# EAGLE design utrak-v2 (EAGLE 7.7.0)
uTrak Balloon Tracker Version 1.0
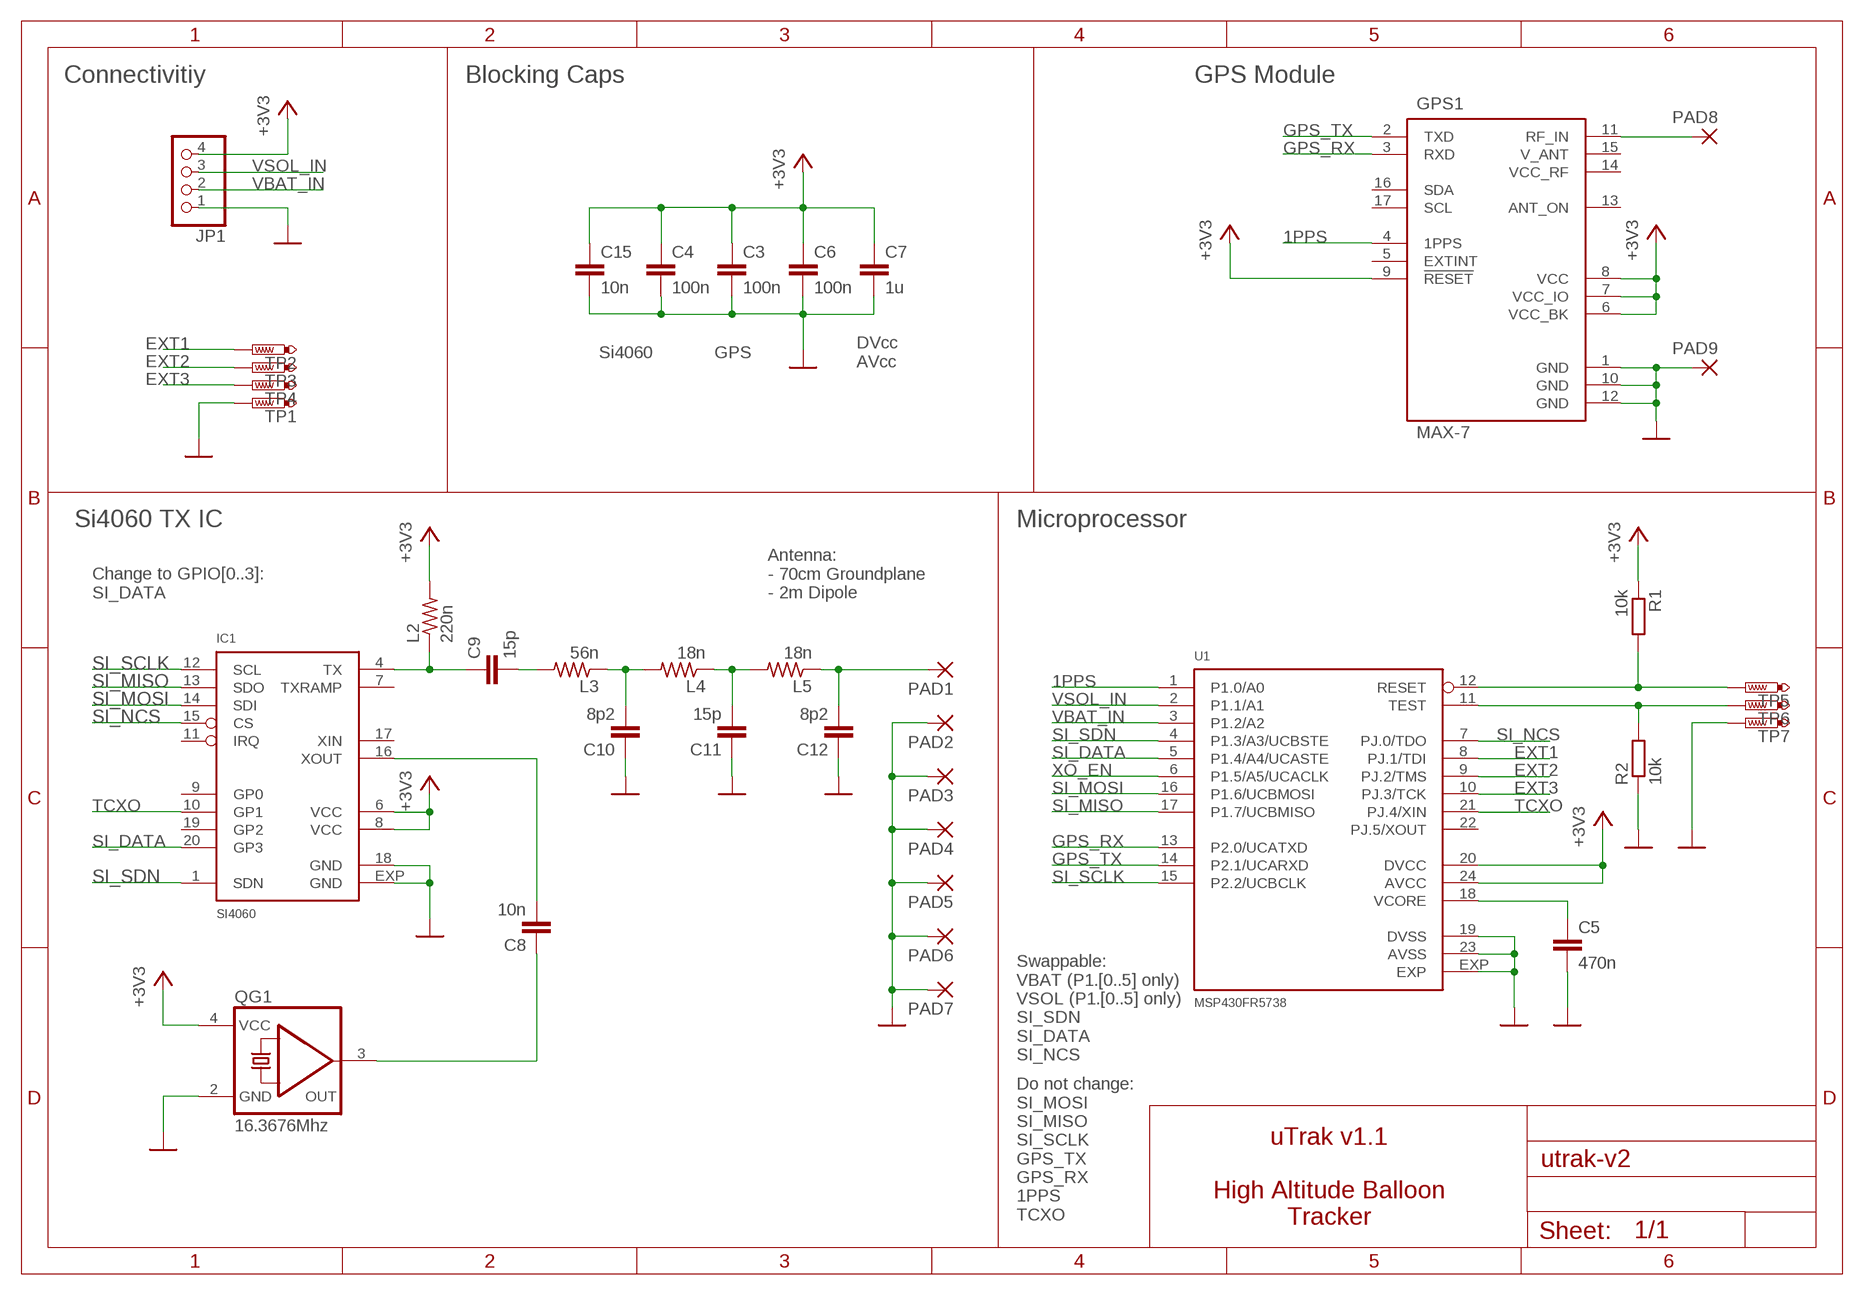
[diagram p0: schematic, sheet 1]

## Parts
C3  100n  C-EUC0402  [C0402]
C4  100n  C-EUC0402  [C0402]
C5  470n  C-EUC0603  [C0603]
C6  100n  C-EUC0402  [C0402]
C7  1u  C-EUC0603  [C0603]
C8  10n  C-EUC0402  [C0402]
C9  15p  C-EUC0402  [C0402]
C10  8p2  C-EUC0402  [C0402]
C11  15p  C-EUC0402  [C0402]
C12  8p2  C-EUC0402  [C0402]
C15  10n  C-EUC0402  [C0402]
GPS1  MAX-7  [UBLOX-7]
IC1  SI4060  [QFN20]
JP1  PINHD-1X4  [1X04]
L2  220n  R-US_R0603  [R0603]
L3  56n  R-US_R0603  [R0603]
L4  18n  R-US_R0603  [R0603]
L5  18n  R-US_R0603  [R0603]
PAD1  SMD2  [SMD1,27-2,54]
PAD2  SMD2  [SMD1,27-2,54]
PAD3  SMD2  [SMD1,27-2,54]
PAD4  SMD2  [SMD1,27-2,54]
PAD5  SMD2  [SMD1,27-2,54]
PAD6  SMD2  [SMD1,27-2,54]
PAD7  SMD2  [SMD1,27-2,54]
PAD8  SMD2  [SMD1,27-2,54]
PAD9  SMD2  [SMD1,27-2,54]
QG1  16.3676Mhz  XO  [CTS406]
R1  10k  R-EU_R0402  [R0402]
R2  10k  R-EU_R0402  [R0402]
TP1  PTR1TP10SQ  [TP10SQ]
TP2  PTR1TP10SQ  [TP10SQ]
TP3  PTR1TP10SQ  [TP10SQ]
TP4  PTR1TP10SQ  [TP10SQ]
TP5  PTR1TP10SQ  [TP10SQ]
TP6  PTR1TP10SQ  [TP10SQ]
TP7  PTR1TP10SQ  [TP10SQ]
U1  MSP430FR5738  [QFN24-4X4]

## Nets
1PPS: GPS1.4(1PPS) U1.1(P1.0/A0)
+3V3: C3.1 C4.1 C6.1 C7.1 C15.1 GPS1.6(VCC_BK) GPS1.7(VCC_IO) GPS1.8(VCC) GPS1.9(!RESET) IC1.6(VCC) IC1.8(VCC) JP1.4 L2.2 QG1.4(VCC) R1.1 U1.20(DVCC) U1.24(AVCC)
EXT1: TP2.TP U1.8(PJ.1/TDI)
EXT2: TP3.TP U1.9(PJ.2/TMS)
EXT3: TP4.TP U1.10(PJ.3/TCK)
GND: C3.2 C4.2 C5.2 C6.2 C7.2 C10.1 C11.1 C12.1 C15.2 GPS1.1(GND) GPS1.10(GND) GPS1.12(GND) IC1.18(GND) IC1.EXP(GND) JP1.1 PAD2.1(P) PAD3.1(P) PAD4.1(P) PAD5.1(P) PAD6.1(P) PAD7.1(P) PAD9.1(P) QG1.2(GND) R2.1 TP1.TP TP7.TP U1.19(DVSS) U1.23(AVSS) U1.EXP
GPS_ANT_+: GPS1.11(RF_IN) PAD8.1(P)
GPS_RX: GPS1.3(RXD) U1.13(P2.0/UCATXD)
GPS_TX: GPS1.2(TXD) U1.14(P2.1/UCARXD)
N$1: C8.2 IC1.16(XOUT)
N$2: C5.1 U1.18(VCORE)
N$5: C9.1 IC1.4(TX) L2.1
N$6: C9.2 L3.2
N$7: C10.2 L3.1 L4.2
N$9: C11.2 L4.1 L5.2
N$10: C12.2 L5.1 PAD1.1(P)
RST: R1.2 TP5.TP U1.12(RESET)
SI_DATA: IC1.20(GP3) U1.5(P1.4/A4/UCASTE)
SI_MISO: IC1.13(SDO) U1.17(P1.7/UCBMISO)
SI_MOSI: IC1.14(SDI) U1.16(P1.6/UCBMOSI)
SI_NCS: IC1.15(CS) U1.7(PJ.0/TDO)
SI_SCLK: IC1.12(SCL) U1.15(P2.2/UCBCLK)
SI_SDN: IC1.1(SDN) U1.4(P1.3/A3/UCBSTE)
TCXO: IC1.10(GP1) U1.21(PJ.4/XIN)
TCXO_OUT: C8.1 QG1.3(OUT)
TST: R2.2 TP6.TP U1.11(TEST)
VBAT_IN: JP1.2 U1.3(P1.2/A2)
VSOL_IN: JP1.3 U1.2(P1.1/A1)
XO_EN: U1.6(P1.5/A5/UCACLK)
Unconnected: GPS1.5(EXTINT) GPS1.13(ANT_ON) GPS1.14(VCC_RF) GPS1.15(V_ANT) GPS1.16(SDA) GPS1.17(SCL) IC1.7(TXRAMP) IC1.9(GP0) IC1.11(IRQ) IC1.17(XIN) IC1.19(GP2) U1.22(PJ.5/XOUT)

## Notes on the sheet
- Connectivitiy | Blocking Caps | GPS Module
- Si4060 | GPS
- DVcc
  AVcc
- Si4060 TX IC | Microprocessor
- Change to GPIO[0..3]:
  SI_DATA
- Antenna:
  - 70cm Groundplane
  - 2m Dipole
- Swappable:
  VBAT (P1.[0..5] only)
  VSOL (P1.[0..5] only)
  SI_SDN
  SI_DATA
  SI_NCS
- uTrak v1.1
  
  High Altitude Balloon
  Tracker
- Do not change:
  SI_MOSI
  SI_MISO
  SI_SCLK
  GPS_TX
  GPS_RX
  1PPS
  TCXO

## Library data of the parts
C3 C4 C6 = rcl:C-EU: CAPACITOR, European symbol; PARTNO: 81-GRM155R71C104KA88
C5 = rcl:C-EU: CAPACITOR, European symbol; PARTNO: 81-GCM188R71C474KA5D
C7 = rcl:C-EU: CAPACITOR, European symbol; PARTNO: 81-GRM39R105K10
C8 C15 = rcl:C-EU: CAPACITOR, European symbol; PARTNO: 81-GRM155R71H103MA8D
C9 C11 = rcl:C-EU: CAPACITOR, European symbol; PARTNO: 81-GRM1555C1H150FA1D
C10 C12 = rcl:C-EU: CAPACITOR, European symbol; PARTNO: 81-GRM1555C1H8R2BA1D
GPS1 = ublox-gps:MAX-7
IC1 = silabs-si6040:SI4060: SI4060 High-Performance, Low-Current Transmitter; PARTNO: 634-SI4060-B1B-FMR
JP1 = pinhead:PINHD-1X4: PIN HEADER; BOM: EXCLUDE
L2 = rcl:R-US_: RESISTOR, American symbol; PARTNO: 994-0603CS-R22XGLW
L3 = rcl:R-US_: RESISTOR, American symbol; PARTNO: 994-0603CS-56NXJLW
L4 L5 = rcl:R-US_: RESISTOR, American symbol; PARTNO: 994-0603CS-18NXJLU
PAD1-PAD9 = wirepad:SMD2: SMD PAD; BOM: EXCLUDE
QG1 = RS92TCXO:XO: CRYSTAL
R1 R2 = rcl:R-EU_: RESISTOR, European symbol; PARTNO: 603-RC0402FR-0710KL
TP1-TP7 = testpad:PTR1: TEST PIN; BOM: EXCLUDE
U1 = msp430-fr:MSP430FR5738: MSP430FR5738 16bit Mixed Signal Microcontroller; PARTNO: 595-SP430FR5738IRGER

## Board
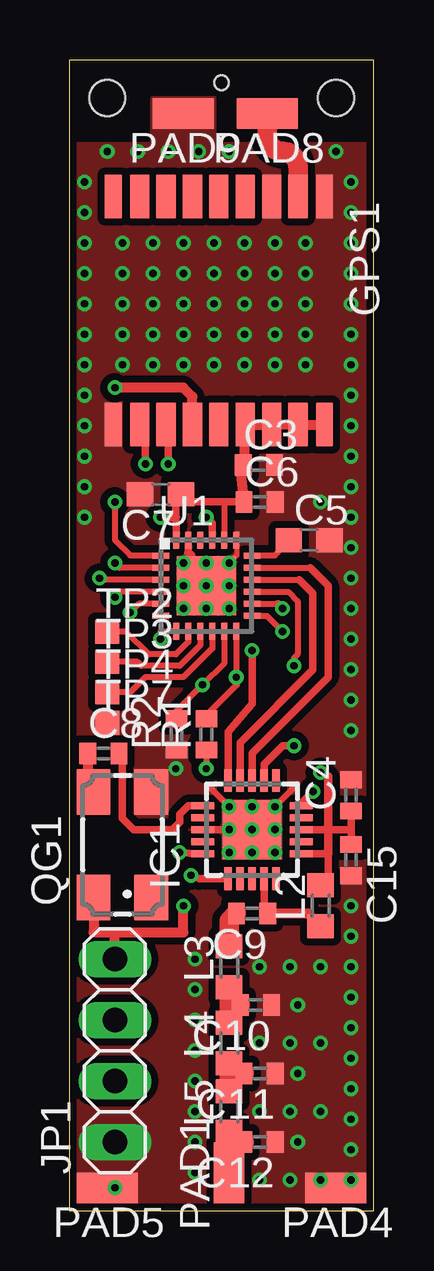
[diagram p1: board, top side]
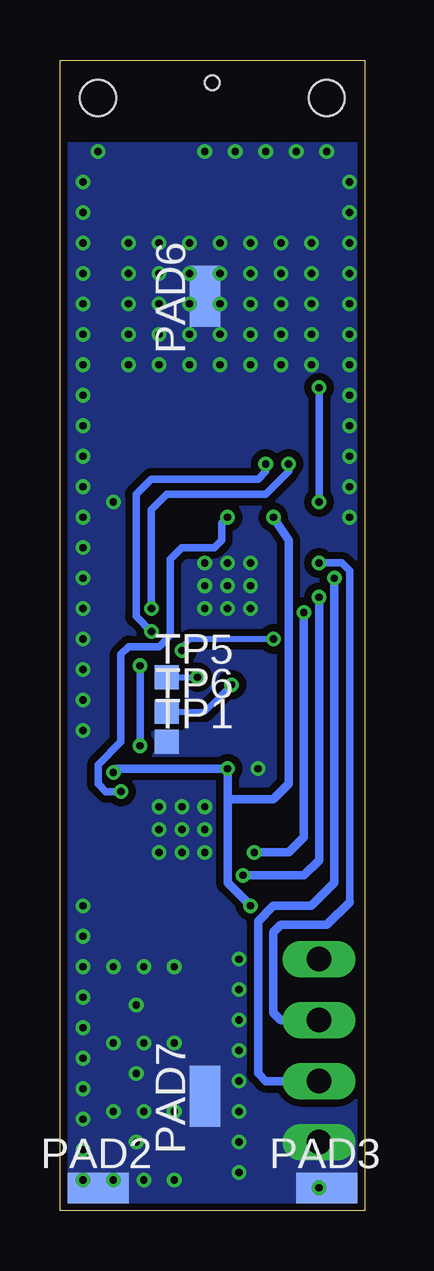
[diagram p2: board, bottom side, seen from below]

Size 12.7 x 47.94 mm. Coordinates in mm from the lower left corner, seen from the top.
Outline: 0,0 12.7,0 12.7,47.94 0,47.94 0,0
Copper layers (1*16): Top 0.035mm / dielectric 1.5mm / Bottom 0.035mm
Design rules "hackvana": minimum track width 6mil, minimum drill 0.3mm, track to track 6mil, track to pad 6mil, pad to pad 6mil, via to via 6mil, smd to smd 0mil, copper to edge 6mil, drill to drill 6mil, minimum pad ring 10mil, minimum via ring 6mil, stop-mask expansion 2mil, vias tented up to drill 100mil, thermal gap 10mil
Holes 1.5 mm at 1.59,46.35 11.11,46.35
Holes 0.6 mm at 6.35,46.99

### Footprints (pad centres in the part's own frame; a part is rotated, then mirrored left to right if it is on the bottom)
C0402 = smd 0.7 x 0.9: 1 -0.65,0; 2 0.65,0
C0603 = smd 1.1 x 1: 1 -0.85,0; 2 0.85,0
UBLOX-7 = smd 1.8 x 0.7: 1 4.838,-4.112; 9 4.838,4.688; 10 -4.662,4.688; 18 -4.662,-4.112 | smd 1.8 x 0.8: 2 4.838,-3.013; 3 4.838,-1.913; 4 4.838,-0.812; 5 4.838,0.287; 6 4.838,1.387; 7 4.838,2.487; 8 4.838,3.587; 11 -4.662,3.587; 12 -4.662,2.487; 13 -4.662,1.387; 14 -4.662,0.287; 15 -4.662,-0.812; 16 -4.662,-1.913; 17 -4.662,-3.013
QFN20 = smd 0.95 x 0.3: 1 -2.05,1; 2 -2.05,0.5; 3 -2.05,0; 4 -2.05,-0.5; 5 -2.05,-1; 11 2.05,-1; 12 2.05,-0.5; 13 2.05,0; 14 2.05,0.5; 15 2.05,1 | smd 0.3 x 0.95: 6 -1,-2.05; 7 -0.5,-2.05; 8 0,-2.05; 9 0.5,-2.05; 10 1,-2.05; 16 1,2.05; 17 0.5,2.05; 18 0,2.05; 19 -0.5,2.05; 20 -1,2.05 | smd 2.45 x 2.45: EXP 0,0
1X04 = drill 1.016 long: 1 -3.81,0; 2 -1.27,0; 3 1.27,0; 4 3.81,0
R0603 = smd 1 x 1.1: 1 -0.85,0; 2 0.85,0
SMD1,27-2,54 = smd 1.27 x 2.54: 1 0,0
CTS406 = smd 1.9 x 1.4: 1 -2.2,-1.2; 2 2.2,-1.2; 3 2.2,1.2; 4 -2.2,1.2
R0402 = smd 0.7 x 0.9: 1 -0.65,0; 2 0.65,0
TP10SQ = smd 1 x 1: TP 0,0
QFN24-4X4 = smd 0.7 x 0.25: 1 -1.9,1.25; 2 -1.9,0.75; 3 -1.9,0.25; 4 -1.9,-0.25; 5 -1.9,-0.75; 6 -1.9,-1.25; 13 1.9,-1.25; 14 1.9,-0.75; 15 1.9,-0.25; 16 1.9,0.25; 17 1.9,0.75; 18 1.9,1.25 | smd 0.25 x 0.7: 7 -1.25,-1.9; 8 -0.75,-1.9; 9 -0.25,-1.9; 10 0.25,-1.9; 11 0.75,-1.9; 12 1.25,-1.9; 19 1.25,1.9; 20 0.75,1.9; 21 0.25,1.9; 22 -0.25,1.9; 23 -0.75,1.9; 24 -1.25,1.9 | smd 2.45 x 2.45: EXP 0,0

### Placement (x,y rotation side)
C3  7.91,31.07 0 top
C4  11.75,17.3 90 top
C5  10,27.94 0 top
C6  7.94,29.53 0 top
C7  3.81,29.84 180 top
C8  1.43,19.05 0 top
C9  7.62,12.38 180 top
C10  7.78,8.57 180 top
C11  7.94,5.71 180 top
C12  7.94,2.86 180 top
C15  11.75,14.61 270 top
GPS1  5.95,37.59 270 top
IC1  7.62,15.88 90 top
JP1  1.91,6.67 90 top
L2  10.48,12.7 90 top
L3  6.67,10.16 90 top
L4  6.67,6.99 90 top
L5  6.67,4.13 90 top
PAD1  6.67,1.59 0 top
PAD2  11.11,0.95 270 bottom
PAD3  1.59,0.95 270 bottom
PAD4  11.11,0.95 90 top
PAD5  1.59,0.95 90 top
PAD6  6.67,38.1 0 bottom
PAD7  6.67,4.76 0 bottom
PAD8  8.26,45.72 90 top
PAD9  4.76,45.72 90 top
QG1  2.22,15.24 90 top
R1  5.71,19.84 90 top
R2  4.47,19.84 90 top
TP1  8.26,19.53 0 bottom
TP2  1.59,24.13 0 top
TP3  1.59,22.86 0 top
TP4  1.59,21.59 0 top
TP5  8.26,22.23 0 bottom
TP6  8.26,20.8 0 bottom
TP7  1.59,20.32 0 top
U1  5.71,26.04 0 top

### Tracks (layer width: path | path; a pad name or v marks a point on that pad's centre or on a via)
1PPS  (via drill 0.3)
  Top 0.254: v1.91,29.53 1.91,27.94 2.54,27.3 3.79,27.3 U1.1
  Top 0.305: U1.1
  Top 0.406: GPS1.4 5.14,33.91 4.76,34.29 v1.91,34.29
  Bottom 0.305: v1.91,34.29 v1.91,29.53
+3V3  (via drill 0.3)
  Top 0.254: C6.1 6.46,29.53 U1.20 | C7.1 4.66,29.74 4.45,29.53 | R1.1 v5.71,18.41
  Top 0.305: U1.24 4.46,28.55 4.45,28.89 4.45,29.53 C6.1 | IC1.8 10.79,15.88 11.75,15.88 | IC1.6 10.79,14.88 10.79,13.55 L2.2 | 11.75,15.88 C15.1 | 11.75,15.88 C4.1 | 7.37,32.72 7.32,32.72 | 7.3,31.16 C3.1
  Top 0.356: v10.48,18.26 10.79,18.1 10.79,15.88 10.79,14.88 | v3.81,28.89 4.45,28.89 | 7.37,32.72 GPS1.6 | 7.32,32.72 7.14,32.54
  Top 0.406: GPS1.6 GPS1.7 GPS1.8 GPS1.9 | 7.14,32.54 7.14,32.38 7.3,32.23 7.3,31.16 | QG1.4 1.02,11.59 1.91,11.59 | 1.91,11.59 4.76,11.59 v4.76,12.7 | JP1.4 1.91,11.59 | C6.1 7.13,31.07 C3.1
  Bottom 0.356: v10.48,18.26 10.32,18.41 v5.71,18.41 5.71,17.14 | 5.71,17.14 5.71,13.65 v4.76,12.7 | v3.81,28.89 3.17,27.94 3.17,17.78 3.81,17.14 5.71,17.14
EXT1
  Top 0.254: U1.8 4.96,23.7 4.45,23.18 3.33,23.18 2.38,24.13 TP2.TP
EXT2
  Top 0.254: U1.9 5.46,23.56 4.6,22.7 3.02,22.7 2.86,22.86 TP3.TP
EXT3
  Top 0.254: U1.10 5.96,23.43 4.76,22.23 3.17,22.23 2.54,21.59 TP4.TP
GND  (via drill 0.3)
  Top 0.203: 6.99,27.94 6.99,27.3 v6.67,26.99
  Top 0.254: IC1.EXP 9.53,17.78 | 7.78,15.72 5.87,17.62
  Top 0.305: U1.23 4.96,27.42 | IC1.18 v6.67,15.88
  Top 0.356: 4.96,27.42 5.08,27.3 5.08,26.67
  other vias: 1.91,0.95 4.76,26.99 5.71,26.99 4.76,26.04 4.76,25.08 5.71,25.08 5.71,26.04 6.67,16.83 6.67,14.92 7.62,14.92 8.57,14.92 8.57,15.88 7.62,15.88 7.62,16.83 8.57,16.83 6.67,26.04 6.67,25.08 9.21,4.13 10.48,4.13 7.94,6.99 9.21,6.99 11.75,10.16 11.75,3.81 11.75,5.08 11.75,7.62 11.75,11.43 10.48,6.99 7.94,4.13 10.48,29.53 11.75,30.16 11.75,26.35 11.75,25.08 11.75,23.81 11.75,22.54 11.75,21.27 7.94,1.27 9.21,1.27 10.48,1.27 11.75,1.27 11.75,2.54 2.22,40.32 3.49,40.32 4.76,40.32 6.03,40.32 7.3,40.32 8.57,40.32 9.84,40.32 2.22,39.05 2.22,37.78 2.22,36.51 2.22,35.24 3.49,35.24 4.76,35.24 6.03,35.24 7.3,35.24 8.57,35.24 9.84,35.24 9.84,36.51 9.84,37.78 9.84,39.05 8.57,39.05 7.3,39.05 6.03,39.05 4.76,39.05 3.49,39.05 3.49,37.78 3.49,36.51 4.76,36.51 6.03,37.78 4.76,37.78 6.03,36.51 7.3,36.51 7.3,37.78 8.57,37.78 8.57,36.51 5.4,44.13 11.11,44.13 11.75,42.86 11.75,41.59 11.75,40.32 11.75,39.05 11.75,37.78 11.75,36.51 11.75,35.24 11.75,33.97 11.75,32.7 11.75,31.43 0.64,32.7 0.64,33.97 0.64,35.24 0.64,36.51 0.64,37.78 0.64,39.05 0.64,40.32 0.64,41.59 0.64,42.86 5.24,2.86 5.24,4.13 5.24,5.4 5.24,6.67 5.24,7.94 4.45,18.41 7.94,10.16 9.21,10.16 10.48,10.16 11.75,8.89 11.75,28.89 11.75,27.62 11.75,20 11.75,12.7 11.75,6.35 1.59,44.13 2.86,44.13 4.13,44.13 6.67,44.13 5.24,1.59 5.24,9.21 5.24,10.48 9.53,8.57 9.53,2.86 9.53,5.71 0.64,31.43 0.64,30.16 0.64,28.89
  pour Top (isolate 0.305, no thermals): 0,0 12.7,0 12.7,44.45 0,44.45
  pour Bottom (isolate 0.305, no thermals): 0,0 12.7,0 12.7,44.45 0,44.45
  pour Top (no thermals): 3.49,46.35 6.03,46.35 6.03,43.81 3.49,43.81
GPS_ANT_+
  Top 0.813: GPS1.11 9.54,43.48 arc90 8.89,44.13 arc-90 8.26,44.77 PAD8.1
GPS_RX  (via drill 0.3)
  Top 0.254: 7.62,24.77 U1.13 8.23,24.79 v8.89,24.13 | 4.13,32.66 GPS1.3
  Top 0.305: v4.13,31.11 4.13,32.66
  Bottom 0.305: v8.89,24.13 9.53,24.77 9.53,29.84 8.89,30.48 4.45,30.48 4.13,30.8 v4.13,31.11
GPS_TX  (via drill 0.3)
  Top 0.254: U1.14 8.69,25.29
  Top 0.305: 8.69,25.29 v8.89,25.08 | v3.17,31.11 3.17,32.52 GPS1.2
  Bottom 0.305: v8.89,25.08 8.89,29.21 8.26,29.84 4.13,29.84 3.17,30.8 v3.17,31.11
N$1
  Top 0.305: IC1.16 4.97,16.88 4.6,16.51 4.6,16.19 4.29,15.88 2.7,15.88 2.22,16.35 2.22,19.21 C8.2
N$2
  Top 0.254: U1.18 8.57,27.3 C5.1
N$5
  Top 0.305: IC1.4 8.12,12.2 C9.1
  Top 0.406: C9.1 9.95,12.38 L2.1
N$6
  Top 0.813: L3.2 6.67,12.08 C9.2
N$7
  Top 0.813: L4.2 6.67,8.57 | 6.67,8.57 L3.1 | C10.2 6.67,8.57
N$9
  Top 0.813: L5.2 6.67,5.71 | 6.67,5.71 L4.1 | C11.2 6.67,5.71
N$10
  Top 0.813: PAD1.1 6.67,2.86 | 6.67,2.86 L5.1 | C12.2 6.67,2.86
RST  (via drill 0.3)
  Top 0.254: R1.2 5.73,20.65 6.99,21.91 6.96,22.25 v6.96,22.23 U1.12
  Bottom 0.254: TP5.TP v6.96,22.23
SI_DATA  (via drill 0.3)
  Top 0.254: U1.5 2.9,25.29 v2.54,24.92
  Top 0.305: IC1.20 5.19,14.88 v4.6,14.92
  Bottom 0.356: v2.54,24.92 2.54,15.56 3.17,14.92 v4.6,14.92
SI_MISO
  Top 0.254: U1.17 10.04,26.79
  Top 0.305: 10.04,26.79 10.79,26.04 10.79,22.23 7.62,19.05 IC1.13
SI_MOSI
  Top 0.254: U1.16 9.59,26.29
  Top 0.305: 9.59,26.29 10.16,25.72 10.16,22.54 7.12,19.5 IC1.14
SI_NCS  (via drill 0.3)
  Top 0.254: U1.7 4.13,24.14 3.81,24.13 v3.81,23.81
  Top 0.305: IC1.15 6.62,19.95 7.62,21.11 v7.62,23.34
  Bottom 0.254: v3.81,23.81 7.3,23.81 7.62,23.5 v7.62,23.34
SI_SCLK  (via drill 0.3)
  Top 0.254: U1.15 9.14,25.79 9.53,25.4 9.53,23.18 9.37,23.02 v9.37,22.7
  Top 0.305: IC1.12 8.12,18.6 8.89,19.37 v9.37,19.37
  Bottom 0.305: v9.37,19.37 v9.37,22.7
SI_SDN  (via drill 0.3)
  Top 0.254: U1.4 2.13,25.79 v1.91,25.56
  Top 0.305: IC1.1 5.41,13.82 v5.08,13.97
  Bottom 0.356: v1.91,25.56 1.91,14.61 2.54,13.97 v5.08,13.97
TCXO  (via drill 0.3)
  Top 0.305: U1.21 5.96,28.64 v5.71,28.89 | IC1.10 9.67,16.97 v10.16,17.46
  Bottom 0.305: v10.16,17.46 10.79,17.46 11.11,17.78 11.11,18.57 10.16,19.53 10.16,23.18 9.84,23.5 8.57,23.5 8.1,23.97 8.1,27.15 7.62,27.62 6.28,27.62 U1.21 5.96,28.64 v5.71,28.89
TCXO_OUT
  Top 0.406: C8.1 0.78,17.44 QG1.3
TST  (via drill 0.3)
  Top 0.254: U1.11 6.46,22.82 v5.56,21.91 4.45,20.8 4.45,20.52 R2.2
  Bottom 0.254: TP6.TP 6.67,20.8 v5.56,21.91
VBAT_IN  (via drill 0.3)
  Top 0.254: U1.3 1.36,26.29 v1.27,26.35
  Bottom 0.356: v1.27,26.35 1.27,13.65 2.22,12.7 3.81,12.7 4.45,12.06 4.45,5.71 4.13,5.4 JP1.2
VSOL_IN  (via drill 0.3)
  Top 0.254: U1.2 2.11,26.79 v1.91,26.99
  Bottom 0.305: v1.91,26.99 0.95,26.99 0.64,26.67 0.64,12.86
  Bottom 0.356: 0.64,12.86 1.59,11.91 3.49,11.91 3.81,11.59 3.81,8.26 3.49,7.94 JP1.3

### Text on the board
bStefan: uTrak GPS Tracker v1.1 / High altitude balloon payload / / www.loetlabor-jena.de